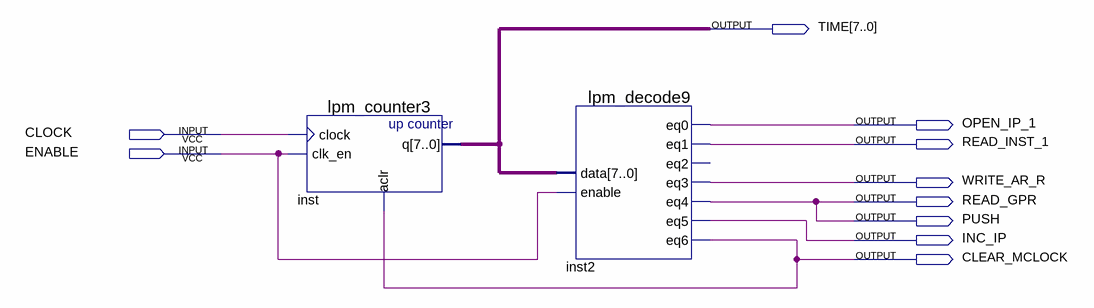
[diagram p0: schematic sheet]
// Quartus schematic PUSH.bdf as structural Verilog: 2 symbols, 10 pins
module PUSH (
  input  CLOCK,
  input  ENABLE,
  output [7:0] TIME,
  output OPEN_IP_1,
  output READ_INST_1,
  output WRITE_AR_R,
  output READ_GPR,
  output PUSH,
  output INC_IP,
  output CLEAR_MCLOCK
);

  lpm_counter3 inst (.clock(CLOCK), .clk_en(ENABLE), .aclr(CLEAR_MCLOCK), .q(TIME));
  lpm_decode9 inst2 (
    .data(TIME), .enable(ENABLE), .eq0(OPEN_IP_1), .eq1(READ_INST_1), .eq3(WRITE_AR_R), .eq4(PUSH),
    .eq5(INC_IP), .eq6(CLEAR_MCLOCK));  // open: eq2

  assign READ_GPR = PUSH;
endmodule
